# EasyEDA Pro project ProProject_OSC_Ver0.2_2023-11-09.epro, board PCB8
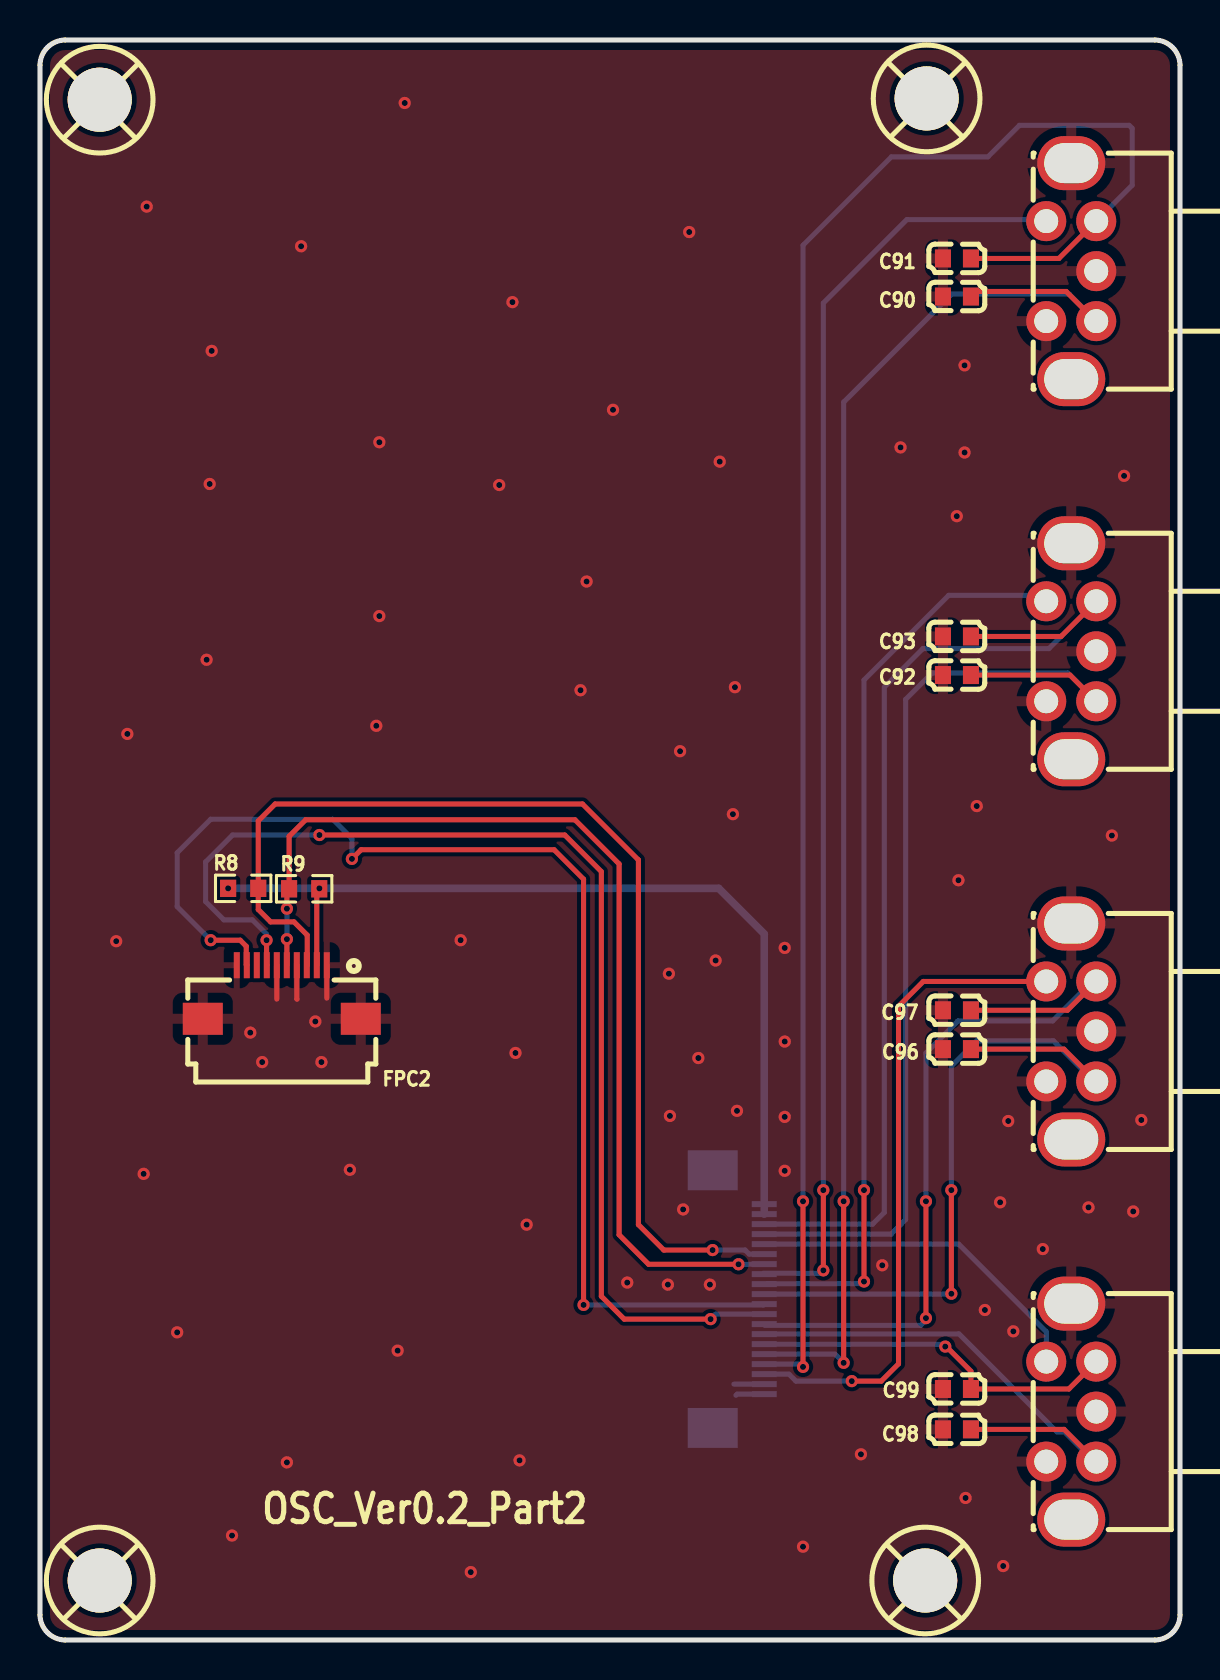
[diagram p8: board, top side]
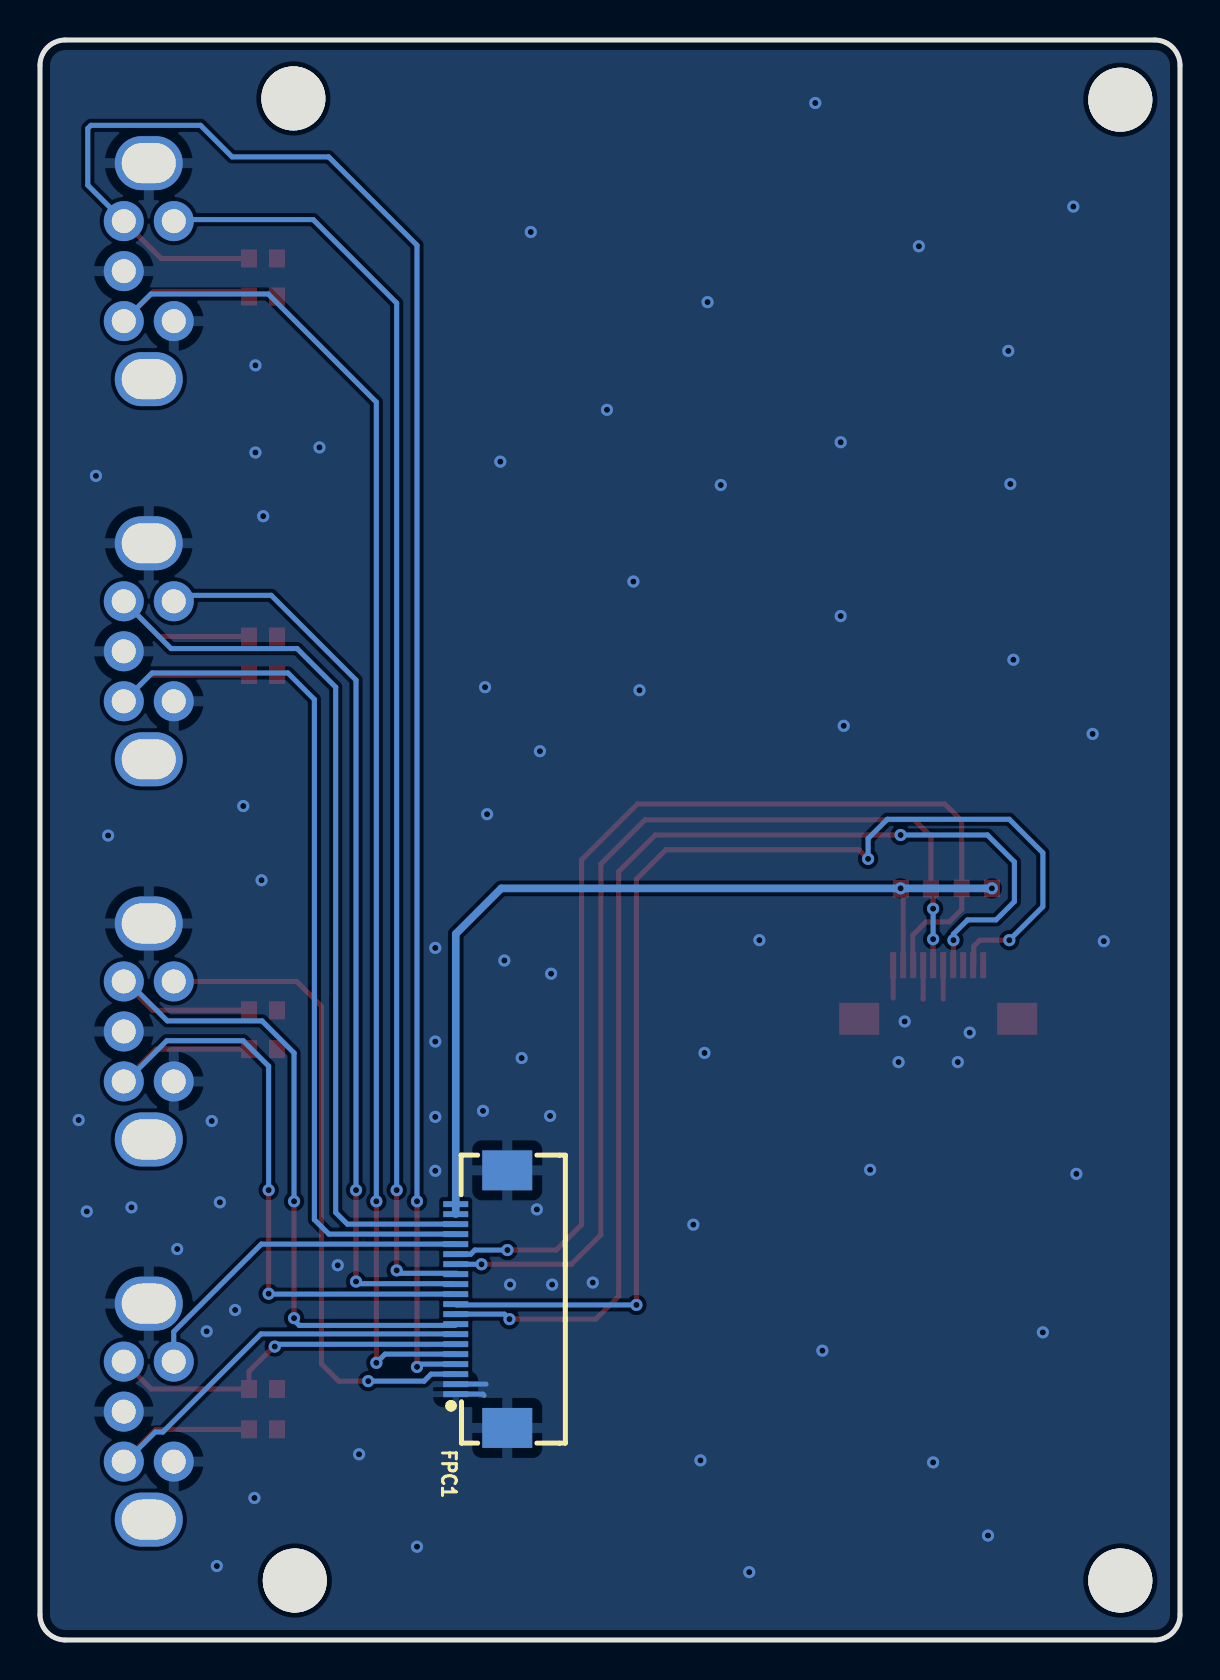
[diagram p9: board, bottom side, seen from below]

Outline 57 x 80 mm; copper layers: Top Layer, Bottom Layer. Coordinates in mm from the lower left corner of the outline.
Outline path: 0,78.73 0,1.27 arc(0.37,0.37) 1.27,0 55.73,0 arc(56.63,0.37) 57,1.27 57,78.73 arc(56.63,79.63) 55.73,80 1.27,80 arc(0.37,79.63) 0,78.73
Stack: Top Layer 0.035mm / Dielectric1 1.51mm FR4 er 4.5 / Bottom Layer 0.035mm

## Design rules (mm)
template: 自定义配置
spacing copperThickness1oz (default): track to track 0.102, other pairs 0.152 to 0.3
spacing copperThickness2oz: track to track 0.203, other pairs 0.152 to 0.3
track width copperThickness1oz (default): min 0.127, default 0.254, max 2.54
track width copperThickness2oz: min 0.203, default 0.254, max 2.54
differential pair differentialPair (default): width min 0.127, default 0.254, max 2.54; gap min 0.152, default 0.152
via viaSize (default): diameter min 0.5, default 0.61, max 10; hole min 0.3, default 0.305, max 6.299

## Placement (name value [footprint] x y rotation side)
C90  100nF  [C0603]  45.85 67.17 0 top
C91  100nF  [C0603]  45.85 69.08 0 top
C92  100nF  [C0603]  45.85 48.25 0 top
C93  100nF  [C0603]  45.85 50.18 0 top
C96  100nF  [C0603]  45.85 29.54 0 top
C97  100nF  [C0603]  45.85 31.49 0 top
C98  100nF  [C0603]  45.85 10.53 0 top
C99  100nF  [C0603]  45.85 12.55 0 top
FPC1  FPC-05F-20PH20  [FPC-SMD_20P-P0.50_XUNPU_FPC-05F-20PH20]  34.93 17.04 90 bottom
FPC2  AFC01-S10FCA-00  [FPC-SMD_P0.5-10P_FGS-XJ-H2.0]  12.09 32.4 180 top
R8  10K  [R0603]  10.16 37.58 0 top
R9  10K  [R0603]  13.21 37.56 180 top
SW6  EC11B15242B1  [SW-TH_EC11B1524XX]  51.56 68.44 0 top
SW7  EC11B15242B1  [SW-TH_EC11B1524XX]  51.56 49.44 0 top
SW8  EC11B15242B1  [SW-TH_EC11B1524XX]  51.56 30.43 0 top
SW9  EC11B15242B1  [SW-TH_EC11B1524XX]  51.56 11.42 0 top
TP1  -  [M3螺丝]  3.05 2.91 0 top
TP2  -  [M3螺丝]  3.05 76.95 0 top
TP3  -  [M3螺丝]  44.4 77.02 0 top
TP4  -  [M3螺丝]  44.32 2.91 0 top
U1  -  [客编]  31.53 16.75 270 bottom

## Footprints (pads in the part's own frame, mm; a bottom-side part is the same pattern mirrored in y, then rotated)
C0603
  rect 0.8x0.9 smd: 1(-0.7,0) 2(0.7,0)
FPC-SMD_20P-P0.50_XUNPU_FPC-05F-20PH20
  rect 0.3x1.25 smd: 1(-4.75,1.288) 2(-4.25,1.288) 3(-3.75,1.288) 4(-3.25,1.288) 5(-2.75,1.288) 6(-2.25,1.288) 7(-1.75,1.288) 8(-1.25,1.288) 9(-0.75,1.288) 10(-0.25,1.288) 11(0.25,1.288) 12(0.75,1.288) 13(1.25,1.288) 14(1.75,1.288) 15(2.25,1.288) 16(2.75,1.288) 17(3.25,1.288) 18(3.75,1.288) 19(4.25,1.288) 20(4.75,1.288)
  rect 2x2.5 smd: 21(6.44,-1.288) 22(-6.44,-1.288)
FPC-SMD_P0.5-10P_FGS-XJ-H2.0
  rect 0.3x1.3 smd: 1(-2.25,-1.339) 2(-1.75,-1.339) 3(-1.25,-1.34) 4(-0.75,-1.339) 5(-0.25,-1.34) 6(0.25,-1.339) 7(0.75,-1.339) 8(1.25,-1.339) 9(1.75,-1.339) 10(2.25,-1.34)
  rect 2x1.6 smd: 11(3.95,1.34) 12(-3.95,1.34)
M3螺丝
  round 3.2 hole 3.2: 1(-0.064,0.064)
R0603
  rect 0.806x0.864 smd: 1(-0.753,0) 2(0.753,0)
SW-TH_EC11B1524XX
  round 2 hole 1.2: A(1.25,-2.5) B(1.25,2.5) C(1.25,-0.001) D(-1.25,-2.5) E(-1.25,2.5)
  oval 3.4x2.7 hole 2.7x2: EH(0,5.4) EH(0,-5.4)

## Nets
As in the schematic.

Pads without a net: FPC2 8; TP1 1; TP2 1; TP3 1; TP4 1

## Via types
v1: diameter 0.61, hole 0.305, Top Layer to Bottom Layer, 96 vias

## Routing (per net, layer and track width the routed paths; a pad name or vN(x,y) marks a point on that pad's centre or on a via; arc(x,y) is an arc through that point)
+3V3: length 45.6
  Top Layer w0.254: 13.84,33.74 13.84,37.45 v1(13.97,37.58)
  Bottom Layer w0.381: FPC1.19 FPC1.20 36.21,35.3 33.93,37.58 v1(13.97,37.58) 9.5,37.58 9.45,37.63
  vias: v1(9.41,37.58)
GND: length 8
  Top Layer w0.254: 14.34,33.74 14.34,32.1 ; 12.85,32.05 12.84,32.06 12.84,33.74 ; 11.84,33.74 11.84,32.05
  Bottom Layer w0.254: 34.8,12.23 34.86,12.29 FPC1.1 ; FPC1.2 34.7,12.79
  vias: v1(3.81,34.94) v1(4.37,45.3) v1(5.18,23.31) v1(5.33,71.67) v1(6.86,15.38) v1(8.33,49.01) v1(8.48,57.8) v1(8.59,64.45) v1(9.6,5.22) v1(10.52,30.37) v1(11.11,28.89) v1(12.34,8.88) v1(13.06,69.69) v1(13.77,30.93) v1(14.07,28.89) v1(15.49,23.51) v1(16.81,45.71) v1(16.97,59.89) v1(16.97,51.2) v1(17.88,14.47) v1(18.24,76.85) v1(21.03,34.99) v1(21.54,3.39) v1(22.96,57.75) v1(23.62,66.89) v1(23.77,29.35) v1(23.98,8.98) v1(24.33,20.77) v1(27.03,47.49) v1(27.33,52.92) v1(28.65,61.51) v1(29.36,17.87) v1(31.44,33.31) v1(31.39,17.77) v1(31.5,26.2) v1(32,44.44) v1(32.16,21.53) v1(32.46,70.4) v1(32.92,29.1) v1(33.5,17.77) v1(33.78,33.97) v1(33.99,58.92) v1(34.65,41.29) v1(34.75,47.64) v1(34.85,26.46) v1(37.24,34.6) v1(37.24,29.92) v1(37.24,26.16) v1(37.24,23.46) v1(38.15,4.66) v1(41.05,9.29) v1(42.11,18.74) v1(43.03,59.63) v1(45.84,56.19) v1(45.92,37.99) v1(46.23,63.73) v1(46.23,59.38) v1(46.28,7.1) v1(46.84,41.7) v1(47.24,16.5) v1(48.01,21.88) v1(48.16,3.7) v1(48.41,25.95) v1(48.67,15.43) v1(50.14,19.55) v1(52.43,21.63) v1(53.59,40.22) v1(54.2,58.21) v1(54.66,21.43) v1(55.07,26)
EC1_A: length 74.6
  Top Layer w0.254: SW6.A 52.79,65.94 51.31,67.43 46.8,67.43 C90.2 ; v1(40.18,21.94) v1(40.18,13.86)
  Bottom Layer w0.254: v1(40.18,13.86) 39.75,14.29 FPC1.5 ; SW6.A 51.46,67.3 45.59,67.3 40.18,61.89 v1(40.18,21.94)
EC1_B: length 89.5
  Top Layer w0.254: v1(38.15,13.66) v1(38.15,21.94) ; C91.2 50.95,69.08 SW6.B
  Bottom Layer w0.254: v1(38.15,21.94) 38.15,69.74 42.57,74.16 47.4,74.16 48.97,75.73 54.46,75.73 54.61,75.58 54.61,72.74 SW6.B ; v1(38.15,13.66) 38.01,13.79 FPC1.4
EC1_KEY: length 64.8
  Top Layer w0.254: v1(39.17,22.49) v1(39.17,18.48)
  Bottom Layer w0.254: 36.16,18.34 39.02,18.34 v1(39.17,18.48) ; 50.63,70.69 50.31,71.02 43.34,71.02 39.17,66.85 v1(39.17,22.49)
EC2_A: length 50.9
  Top Layer w0.254: SW7.A 51.5,48.25 C92.2
  Bottom Layer w0.254: FPC1.17 42.55,20.29 43.28,21.02 43.28,47.03 44.6,48.35 51.4,48.35 SW7.A
EC2_B: length 51.9
  Top Layer w0.254: C93.2 51.05,50.18 SW7.B
  Bottom Layer w0.254: SW7.B 50.45,49.57 44.15,49.57 42.22,47.64 42.22,21.38 41.63,20.79 FPC1.18
EC2_KEY: length 46
  Top Layer w0.254: v1(41.2,22.49) v1(41.2,17.92)
  Bottom Layer w0.254: v1(41.2,17.92) 41.09,17.81 36.34,17.81 ; v1(41.2,22.49) 41.2,48 45.44,52.23 49.43,52.23 50.13,51.53
EC3_A: length 35.8
  Top Layer w0.254: v1(45.57,17.31) v1(45.57,22.49) ; C96.2 51.2,29.54 SW8.A
  Bottom Layer w0.254: v1(45.57,22.49) 45.57,28.69 46.84,29.96 50.67,29.96 52.54,28.09 ; 36.41,17.29 45.55,17.29 v1(45.57,17.31)
EC3_B: length 38.4
  Top Layer w0.254: C97.2 51.37,31.49 SW8.B ; v1(44.3,16.09) v1(44.3,21.94)
  Bottom Layer w0.254: v1(44.3,16.09) 44.3,15.99 44.03,15.73 36.24,15.73 ; 52.78,32.94 52.62,32.94 50.64,30.96 45.9,30.96 44.3,29.35 v1(44.3,21.94)
EC3_KEY: length 33
  Top Layer w0.254: SW8.E 44.16,32.93 42.93,31.69 42.93,13.81 42.06,12.94 v1(40.59,12.94)
  Bottom Layer w0.254: v1(40.59,12.94) 37.79,12.94 37.45,13.29 FPC1.3
EC4_A: length 25.5
  Top Layer w0.254: C98.2 51.2,10.53 SW9.A
  Bottom Layer w0.254: 36.32,15.3 45.95,15.3 50.85,10.4 51.24,10.4 52.37,9.27
EC4_B: length 18.6
  Top Layer w0.254: v1(45.26,14.67) 45.31,14.67 46.55,13.44 C99.2 51.44,12.55 SW9.B
  Bottom Layer w0.254: 36.21,14.79 45.15,14.79 v1(45.26,14.67)
EC4_KEY: length 17.4
  Bottom Layer w0.254: SW9.E 50.31,15.42 45.93,19.79 FPC1.16
TP_INIT: length 61.5
  Top Layer w0.254: v1(15.6,39.06) 16.05,39.51 25.71,39.51 27.18,38.04 v1(27.18,16.75) ; v1(8.53,34.99) 10.01,34.99 10.31,34.69 10.31,33.77 10.34,33.74
  Bottom Layer w0.254: FPC1.10 36.17,16.75 v1(27.18,16.75) ; v1(8.53,34.99) 6.86,36.67 6.86,39.36 8.53,41.04 14.63,41.04 15.6,40.07 v1(15.6,39.06)
TP_RST: length 58.3
  Top Layer w0.254: v1(33.53,16.04) 29.21,16.04 28.07,17.19 28.07,38.42 26.24,40.25 v1(13.97,40.25) ; v1(11.33,34.99) 11.33,33.75 11.34,33.74
  Bottom Layer w0.254: v1(11.33,34.99) 11.33,35.3 10.62,36.01 9.19,36.01 8.28,36.92 8.28,38.9 9.63,40.25 v1(13.97,40.25) ; FPC1.9 33.78,16.29 v1(33.53,16.04)
TP_SCL: length 54.6
  Top Layer w0.254: v1(33.63,19.5) 31.19,19.5 29.92,20.77 29.92,39 27.13,41.8 11.76,41.8 10.91,40.95 R8.2 10.91,36.52 11.53,35.91 12.7,35.91 13.36,35.25 13.36,33.76 FPC2.3
  Bottom Layer w0.254: FPC1.15 35.46,19.29 35.26,19.5 v1(33.63,19.5)
TP_SDA: length 50.7
  Top Layer w0.254: FPC2.5 12.34,33.74 v1(12.34,35.04) ; v1(12.34,36.57) 12.34,37.45 R9.2 12.45,40.18 13.28,41.01 26.75,41.01 28.96,38.8 28.96,20.26 30.43,18.79 v1(34.93,18.79)
  Bottom Layer w0.254: v1(12.34,36.57) v1(12.34,35.04) ; v1(34.93,18.79) 36.21,18.79 FPC1.14

## Copper pours and planes (outline as drawn; the poured copper is in the pictures)
GND on Top Layer: 0,80 57,80 57,0 0,0
GND on Bottom Layer: 0,80 57.15,80 57.15,-0.21 0,-0.21

## Text on the board
Top Silkscreen Layer: OSC_Ver0.2_Part2
